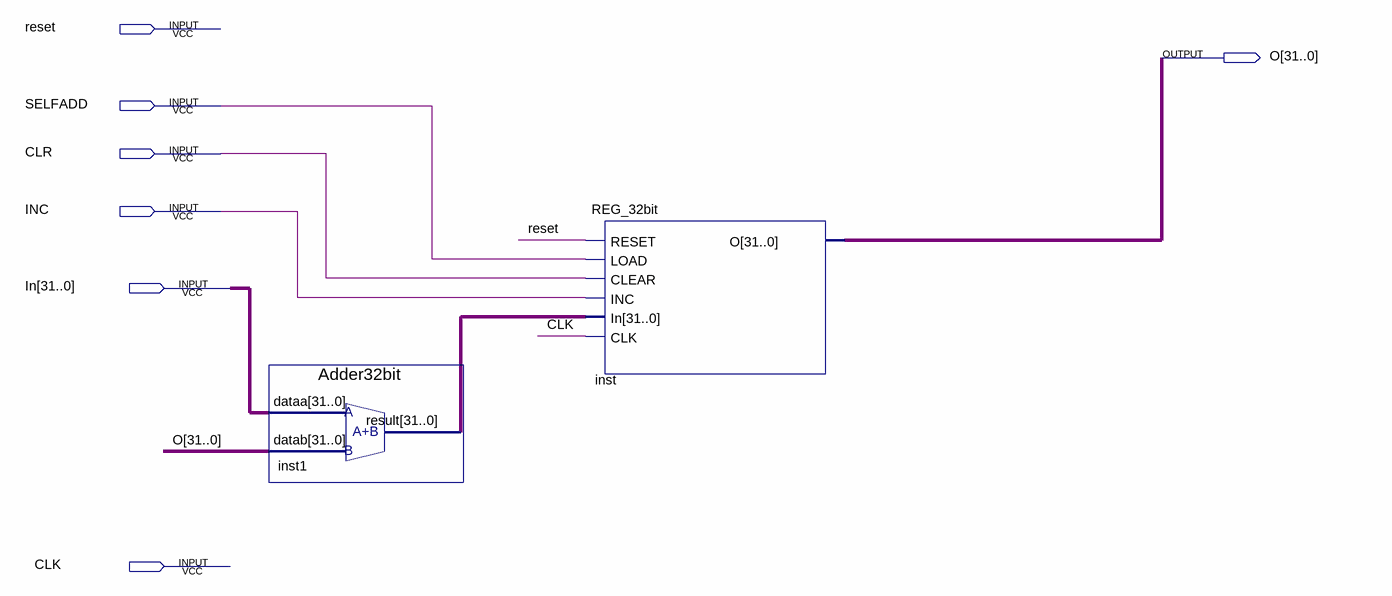
[diagram p0: schematic sheet]
// Quartus schematic PC.bdf as structural Verilog: 2 symbols, 7 pins
module PC (
  input  reset,
  input  SELFADD,
  input  CLR,
  input  INC,
  input  [31:0] In,
  input  CLK,
  output [31:0] O
);

  wire [31:0] inst1_result;

  Adder32bit inst1 (.dataa(In), .datab(O), .result(inst1_result));
  REG_32bit inst (.RESET(reset), .LOAD(SELFADD), .CLEAR(CLR), .INC(INC), .In(inst1_result), .CLK(CLK), .O(O));
endmodule
